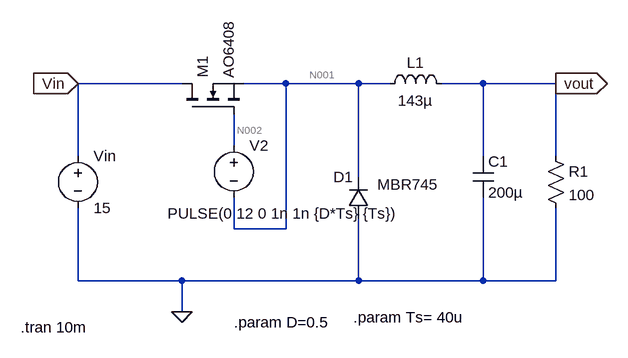
[diagram p0: schematic Draft1.asc]
Draft1.asc, the LTspice schematic file:
Version 4.1
SHEET 1 880 680
WIRE -144 -16 -304 -16
WIRE 16 -16 -48 -16
WIRE 128 -16 16 -16
WIRE 176 -16 128 -16
WIRE 320 -16 256 -16
WIRE 432 -16 320 -16
WIRE -64 80 -64 32
WIRE -304 96 -304 -16
WIRE 320 96 320 -16
WIRE 432 96 432 -16
WIRE 128 128 128 -16
WIRE -64 208 -64 160
WIRE 16 208 16 -16
WIRE 16 208 -64 208
WIRE -304 288 -304 176
WIRE -144 288 -304 288
WIRE 128 288 128 192
WIRE 128 288 -144 288
WIRE 320 288 320 160
WIRE 320 288 128 288
WIRE 432 288 432 176
WIRE 432 288 320 288
WIRE -144 336 -144 288
FLAG -144 336 0
FLAG -304 -16 Vin
IOPIN -304 -16 In
FLAG 432 -16 vout
IOPIN 432 -16 Out
SYMBOL diode 144 192 R180
WINDOW 0 24 64 Left 2
WINDOW 3 -107 52 Left 2
SYMATTR InstName D1
SYMATTR Value MBR745
SYMBOL voltage -304 80 R0
WINDOW 123 0 0 Left 0
WINDOW 39 0 0 Left 0
SYMATTR InstName Vin
SYMATTR Value 15
SYMBOL res 416 80 R0
SYMATTR InstName R1
SYMATTR Value 100
SYMBOL ind 160 0 R270
WINDOW 0 32 56 VTop 2
WINDOW 3 5 56 VBottom 2
SYMATTR InstName L1
SYMATTR Value 143µ
SYMBOL cap 304 96 R0
SYMATTR InstName C1
SYMATTR Value 200µ
SYMBOL nmos -144 32 R270
SYMATTR InstName M1
SYMATTR Value AO6408
SYMBOL voltage -64 64 R0
WINDOW 3 -102 120 Left 2
WINDOW 123 0 0 Left 0
WINDOW 39 0 0 Left 0
SYMATTR Value PULSE(0 12 0 1n 1n {D*Ts} {Ts})
SYMATTR InstName V2
TEXT -392 360 Left 2 !.tran 10m
TEXT -64 352 Left 2 !.param D=0.5
TEXT 120 344 Left 2 !.param Ts= 40u

The netlist it stands for:
* Draft1.asc
D1 0 N001 MBR745
Vin Vin 0 15
R1 vout 0 100
L1 N001 vout 143µ
C1 vout 0 200µ
M1 Vin N002 N001 N001 AO6408
V2 N002 N001 PULSE(0 12 0 1n 1n {D*Ts} {Ts})
.model D D
.lib standard.dio
.model NMOS NMOS
.model PMOS PMOS
.lib standard.mos
.tran 10m
.param D=0.5
.param Ts= 40u
.backanno
.end

* Results of the author's LTspice run, read from the files saved beside the schematic
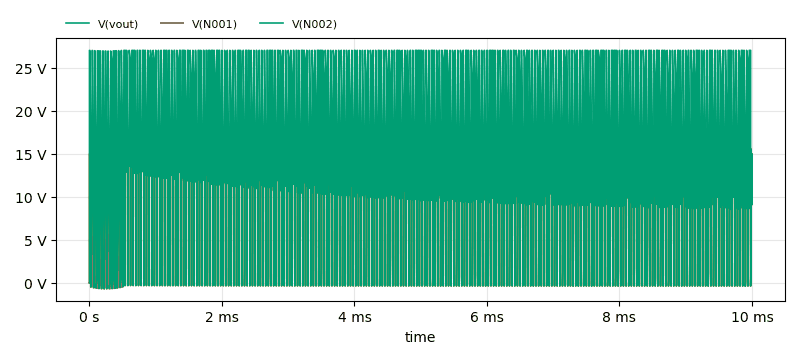
[diagram p1: Transient Analysis of Draft1.asc, plotted from the saved traces]
* Transient Analysis, 1 run:
*   V(vout): min 0 V, max 14.25 V, average 12.59 V, rms 12.71 V, last 12.27 V
*   V(N001): min -684.4 mV, max 15.54 V, average 12.59 V, rms 13.47 V, last 14.96 V
*   V(N002): min -684.4 mV, max 27 V, average 18.59 V, rms 20.82 V, last 14.96 V